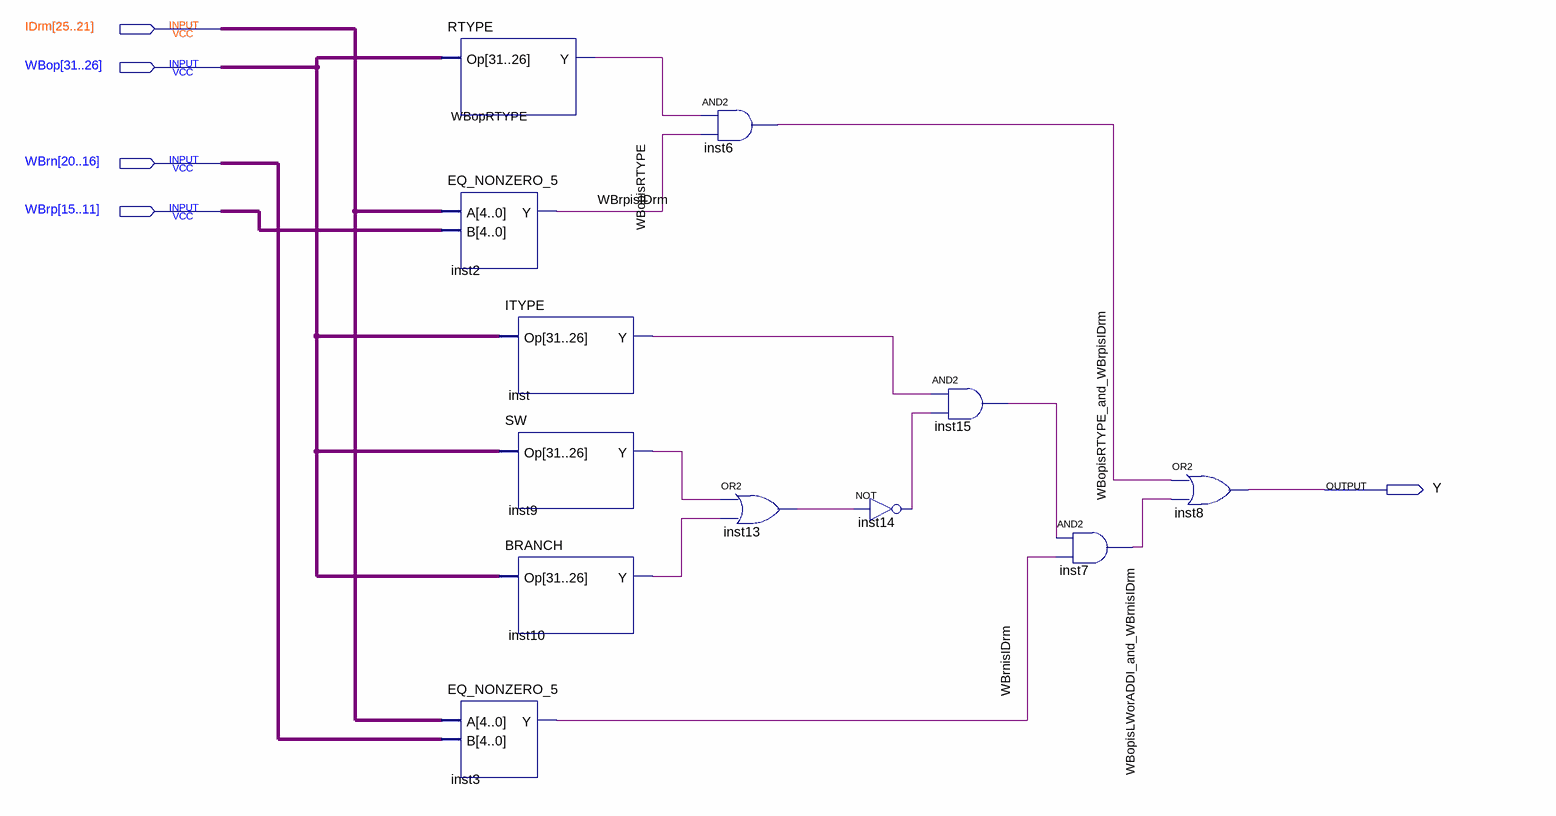
[diagram p0: schematic sheet]
// Quartus schematic ForwardAfromWBtoID.bdf as structural Verilog: 12 symbols, 5 pins
module ForwardAfromWBtoID (
  input  [25:21] IDrm,
  input  [31:26] WBop,
  input  [20:16] WBrn,
  input  [15:11] WBrp,
  output Y
);

  wire inst9_y, inst10_y, inst13_out, inst14_out, inst15_out, inst_y, WBopisLWorADDI_and_WBrnisIDrm,
       WBopisRTYPE, WBopisRTYPE_and_WBrpisIDrm, WBrnisIDrm, WBrpisIDrm;

  RTYPE WBopRTYPE (.Op(WBop), .Y(WBopisRTYPE));
  EQ_NONZERO_5 inst2 (.A(IDrm), .B(WBrp), .Y(WBrpisIDrm));
  ITYPE inst (.Op(WBop), .Y(inst_y));
  SW inst9 (.Op(WBop), .Y(inst9_y));
  BRANCH inst10 (.Op(WBop), .Y(inst10_y));
  EQ_NONZERO_5 inst3 (.A(IDrm), .B(WBrn), .Y(WBrnisIDrm));
  and inst6 (WBopisRTYPE_and_WBrpisIDrm, WBopisRTYPE, WBrpisIDrm);
  or inst13 (inst13_out, inst9_y, inst10_y);
  not inst14 (inst14_out, inst13_out);
  and inst15 (inst15_out, inst_y, inst14_out);
  and inst7 (WBopisLWorADDI_and_WBrnisIDrm, inst15_out, WBrnisIDrm);
  or inst8 (Y, WBopisRTYPE_and_WBrpisIDrm, WBopisLWorADDI_and_WBrnisIDrm);
endmodule
